# Altium project stm8_sensor.PrjPcb
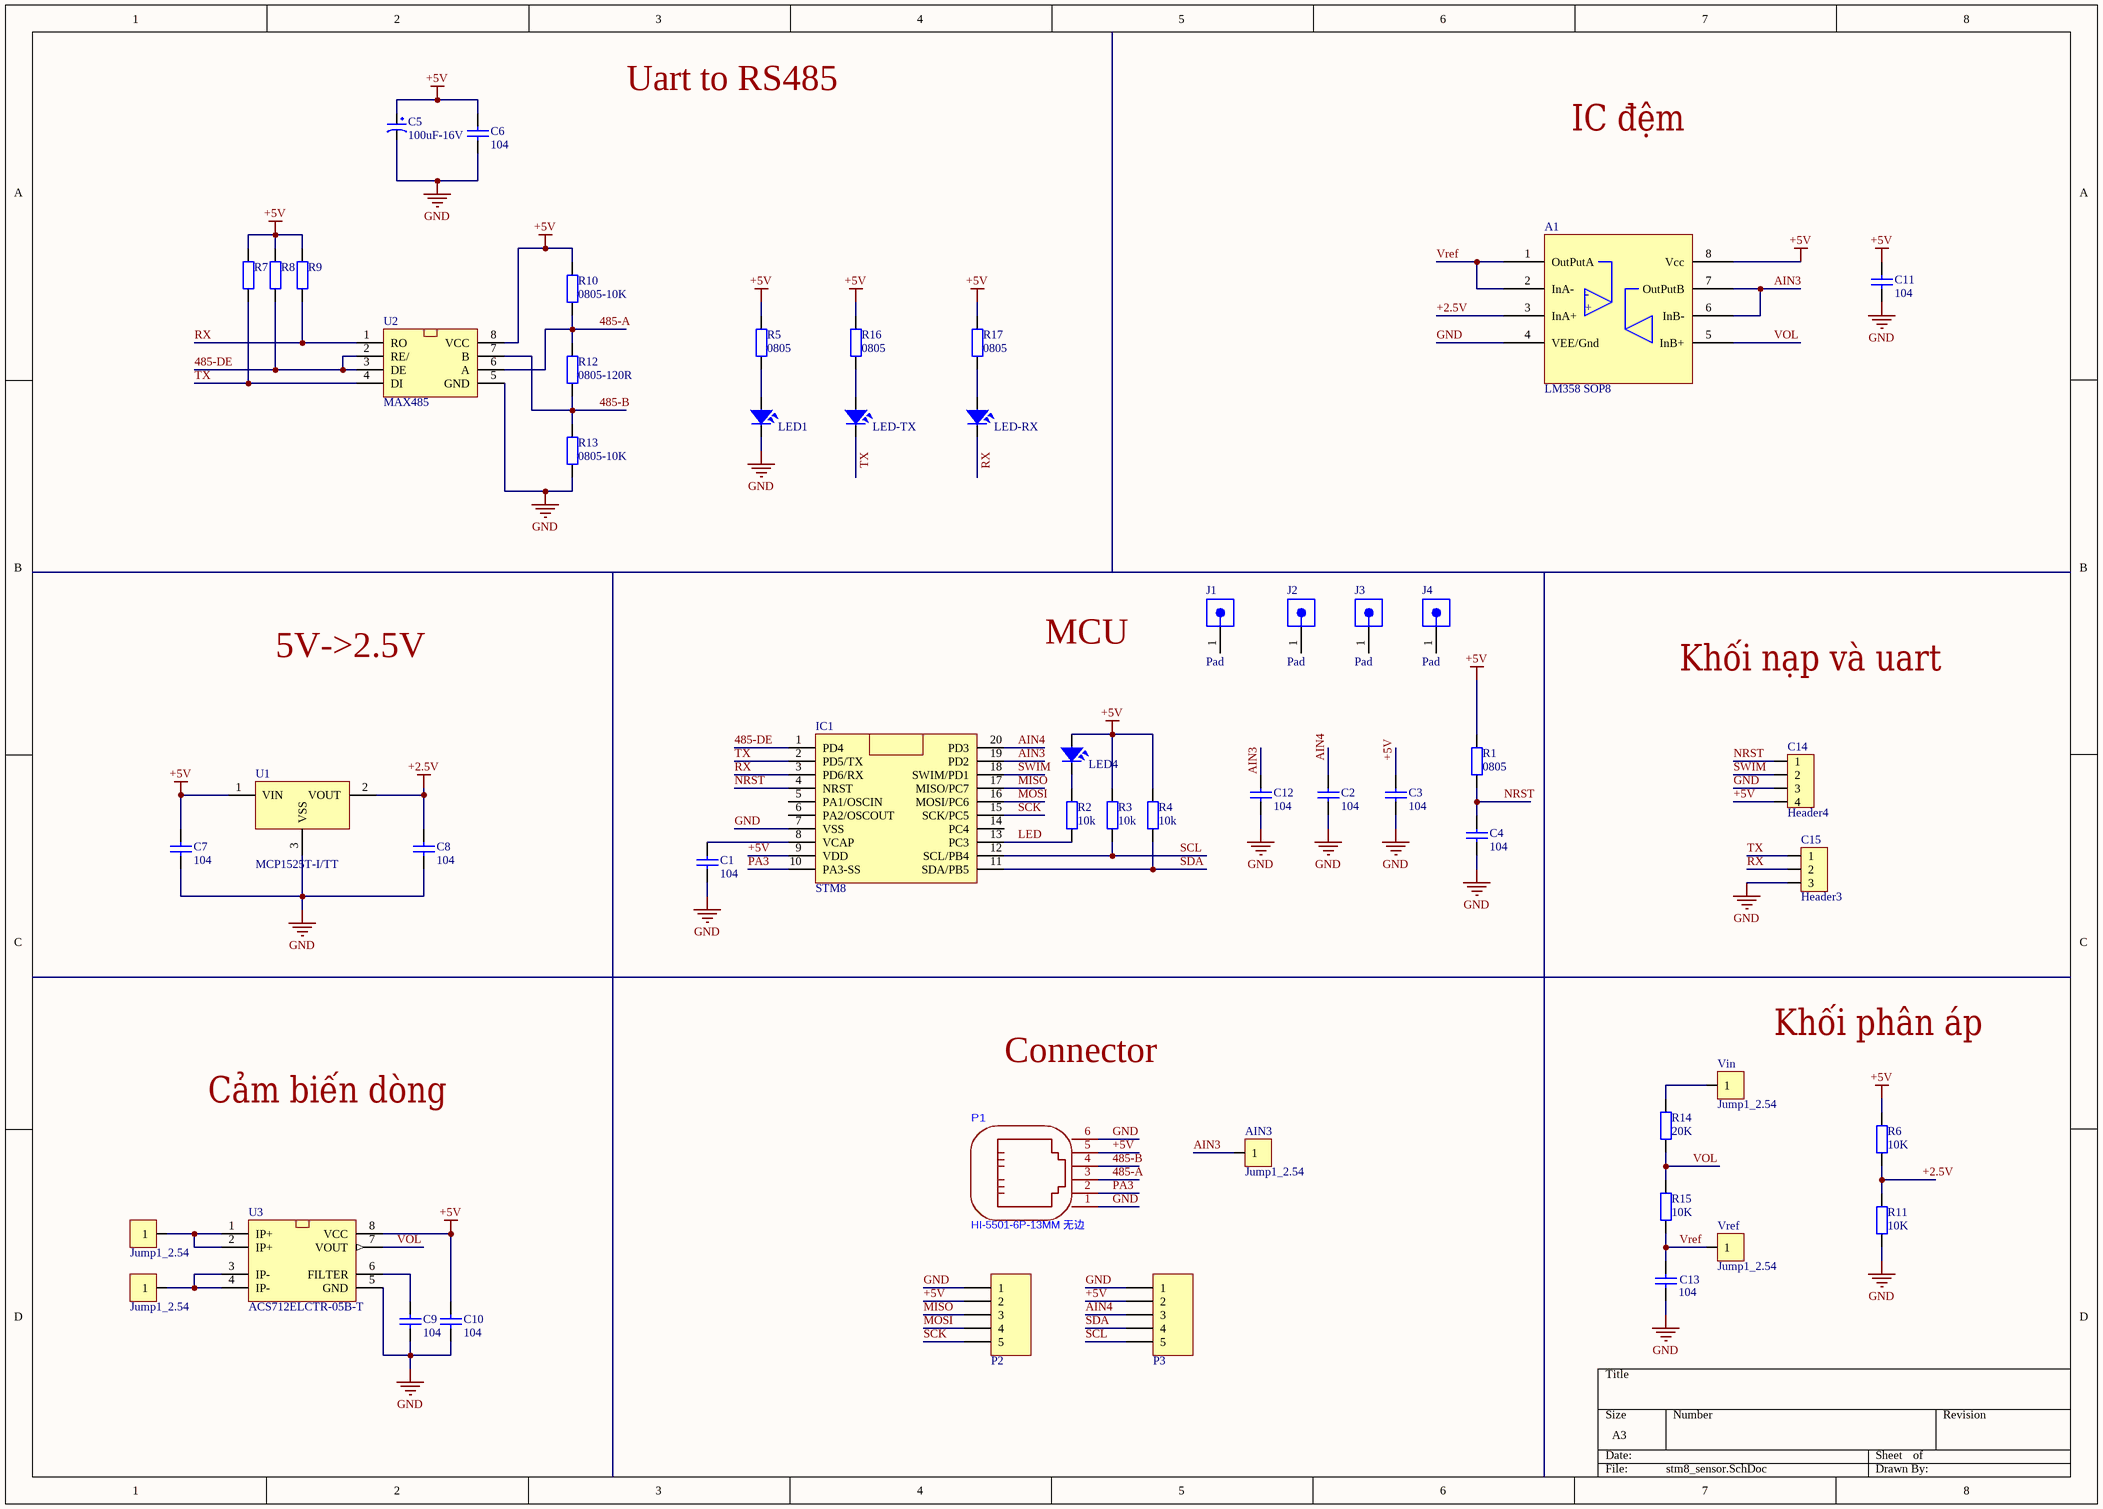
[diagram p0: stm8_sensor.SchDoc]
1 sheet, 53 parts. Net scope: global (net labels, ports and power ports of the same name join across sheets).
Board file: stm8_sensor.PcbDoc

## Sheet stm8_sensor.SchDoc
size A3; SheetNumber: 1; SheetTotal: 1

### Parts
A1  LM358 SOP8  [LM358_SOIC]
AIN3  Jump1_2.54  [jump1_2.54]
C1  104  [0805]
C2  104  [0805]
C3  104  [0805]
C4  104  [0805]
C5  100uF-16V  [tu tantalum smd3216]
C6  104  [tu 0805]
C7  104  [Tu 0805]
C8  104  [Tu 0805]
C9  104  [Tu 0805]
C10  104  [Tu 0805]
C11  104  [Tu 0805]
C12  104  [0805]
C13  104  [Tu 0805]
C14  Header4  [Header4]
C15  Header3  [Header3]
IC1  STM8  [TSSOP 20PIN]
IP+  Jump1_2.54  [jump1_2.54]
IP-  Jump1_2.54  [jump1_2.54]
J1  Pad  [Pad_4.5x4.5_hole_3.2mm_no_legend]
J2  Pad  [Pad_4.5x4.5_hole_3.2mm_no_legend]
J3  Pad  [Pad_4.5x4.5_hole_3.2mm_no_legend]
J4  Pad  [Pad_4.5x4.5_hole_3.2mm_no_legend]
LED1  LED  [LED-5-Yellow]  (value not drawn)
LED4  LED  [LED-5-RED]  (value not drawn)
LED-RX  LED  [LED-5-Green]  (value not drawn)
LED-TX  LED  [LED-5-BLUE]  (value not drawn)
P1  HI-5501-6P-13MM 无边  [RJ11-TH_PCB-6P6C-90]
P2  Connector  [JST-XH_B5B-XH-A]  (value not drawn)
P3  Connector  [JST-XH_B5B-XH-A]  (value not drawn)
R1  value 0805  [DIEN TRO 0805]  (hidden comment: R0805)
R2  value 10k  [DIEN TRO 0805]  (hidden comment: R0805)
R3  value 10k  [DIEN TRO 0805]  (hidden comment: R0805)
R4  value 10k  [DIEN TRO 0805]  (hidden comment: R0805)
R5  value 0805  [DIEN TRO 0805]  (hidden comment: R0805)
R6  value 10K  [DIEN TRO 0805]  (hidden comment: R0805)
R7  R0805  [DIEN TRO 0805]  (value not drawn)
R8  R0805  [DIEN TRO 0805]  (value not drawn)
R9  R0805  [DIEN TRO 0805]  (value not drawn)
R10  value 0805-10K  [DIEN TRO 0805]  (hidden comment: R0805)
R11  value 10K  [DIEN TRO 0805]  (hidden comment: R0805)
R12  value 0805-120R  [DIEN TRO 0805]  (hidden comment: R0805)
R13  value 0805-10K  [DIEN TRO 0805]  (hidden comment: R0805)
R14  value 20K  [DIEN TRO 0805]  (hidden comment: R0805)
R15  value 10K  [DIEN TRO 0805]  (hidden comment: R0805)
R16  value 0805  [DIEN TRO 0805]  (hidden comment: R0805)
R17  value 0805  [DIEN TRO 0805]  (hidden comment: R0805)
U1  MCP1525T-I/TT  [SOT23]
U2  MAX485  [SOP8_L]
U3  ACS712ELCTR-05B-T  [SOP8_L]
Vin  Jump1_2.54  [jump1_2.54]
Vref  Jump1_2.54  [jump1_2.54]

### Nets
+2.5V: A1.3(InA+) C8.2 R6.1 R11.2 U1.2(VOUT)
+5V: A1.8(Vcc) C3.2 C5.1 C6.1 C7.2 C10.2 C11.2 C14.4 IC1.9(VDD) LED4.1 P1.5 P2.2 P3.2 R1.2 R3.2 R4.2 R5.2 R6.2 R7.2 R8.2 R9.2 R10.2 R16.2 R17.2 U1.1(VIN) U2.8(VCC) U3.8(VCC)
GND: A1.4(VEE/Gnd) C1.1 C2.1 C3.1 C4.1 C5.2 C6.2 C7.1 C8.1 C9.1 C10.1 C11.1 C12.2 C13.1 C14.3 C15.3 IC1.7(VSS) LED1.2 P1.1 P1.6 P2.1 P3.1 R11.1 R13.1 U1.3(VSS) U2.5(GND) U3.5(GND)
485-A: P1.3 R10.1 R12.2 U2.6(A)
485-B: P1.4 R12.1 R13.2 U2.7(B)
485-DE: IC1.1(PD4) R8.1 U2.2(RE/) U2.3(DE)
AIN3: A1.6(InB-) A1.7(OutPutB) AIN3.1 C12.1 IC1.19(PD2)
AIN4: C2.2 IC1.20(PD3) P3.3
LED: IC1.13(PC3) R2.1
MISO: IC1.17(MISO/PC7) P2.3
MOSI: IC1.16(MOSI/PC6) P2.4
NRST: C4.2 C14.1 IC1.4(NRST) R1.1
PA3: IC1.10(PA3-SS) P1.2
RX: C15.2 IC1.3(PD6/RX) LED-RX.2 R9.1 U2.1(RO)
SCK: IC1.15(SCK/PC5) P2.5
SCL: IC1.12(SCL/PB4) P3.5 R3.1
SDA: IC1.11(SDA/PB5) P3.4 R4.1
SWIM: C14.2 IC1.18(SWIM/PD1)
TX: C15.1 IC1.2(PD5/TX) LED-TX.2 R7.1 U2.4(DI)
VOL: A1.5(InB+) R14.1 R15.2 U3.7(VOUT)
Vref: A1.1(OutPutA) A1.2(InA-) C13.2 R15.1 Vref.1
NetC1_2: C1.2 IC1.8(VCAP)
NetC9_2: C9.2 U3.6(FILTER)
NetIP+_1: IP+.1 U3.1(IP+) U3.2(IP+)
NetIP-_1: IP-.1 U3.3(IP-) U3.4(IP-)
NetLED1_1: LED1.1 R5.1
NetLED4_2: LED4.2 R2.2
NetLED-RX_1: LED-RX.1 R17.1
NetLED-TX_1: LED-TX.1 R16.1
NetR14_2: R14.2 Vin.1

Not connected (* = marked no-connect by the designer): IC1 5(PA1/OSCIN) 6(PA2/OSCOUT) 14(PC4); J1 1; J2 1; J3 1; J4 1

### Notes on the sheet
- Uart to RS485
- IC đệm
- MCU
- 5V->2.5V
- Khối nạp và uart
- Khối phân áp
- Cảm biến dòng
- Connector
- (in symbol LM358) -; +

### Library data of the parts
A1 = LM358: Dán; Ma_Hang: MH000609; Don_Vi: Con; Ten_Linh_Kien: LM358 SOP8; Kieu_Chan: *; Ghi_Chu: *; Chung_Loai: Dán
AIN3 IP+ IP- Vin Vref = jump_1
C1-C4 C12 = Cap 104_SMD: Capacitor (Semiconductor SIM Model); Value: 0.1uF; Published: 8-Jun-2000; LatestRevisionDate: 17-Jul-2002; LatestRevisionNote: Re-released for DXP Platform.; PackageReference: C1206; Publisher: Altium Limited
C5 = Tu tantalum 1uF 35V SMD3216: Dán; Don_Vi: Con; So_Chan: 2; Ten_Linh_Kien: Tụ tantalum 105V-1uF 35V SMD3216; Ma_Hang: MH007471; Chung_Loai: Dán; Kieu_Chan: *
C6 = Tu 0805 104 50V 10%: Dán; Don_Vi: Con; So_Chan: 2; Ten_Linh_Kien: Tụ 0805 104-100nF 10% 50V; Ma_Hang: MH004551; Chung_Loai: Dán; Kieu_Chan: *
C7-C11 C13 = Tu 104: Dán; Ten_Linh_Kien: Tụ 0805 104-100nF 10% 50V; Don_Vi: Con; Ma_Hang: MH004551; Kieu_Chan: *; Chung_Loai: Dán; Ghi_Chu: *
C14 = Header4: Header IDC, 4 x 1 Pin Vertical 2.54mm Pitch (Non-Boxed, Male); Manufacturer: W¨¹rth Elektronik eiSos GmbH; partNo: 613002143121; ComponentLink1 Description: Manufacturer; ComponentLink2 Description: Datasheet; NoPins: 02; Created Date: 29 March 2013; ComponentLink1URL: http://www.we-online.com; ComponentLink2URL: http://katalog.we-online.de/em/datasheet/6130xx143121.pdf; Created by: Karrer Zheng
C15 = Header3: Header IDC, 3 x 1 Pin Vertical 2.54mm Pitch (Non-Boxed, Male); Manufacturer: W¨¹rth Elektronik eiSos GmbH; partNo: 613002143121; ComponentLink1 Description: Manufacturer; ComponentLink2 Description: Datasheet; NoPins: 02; Created Date: 29 March 2013; ComponentLink1URL: http://www.we-online.com; ComponentLink2URL: http://katalog.we-online.de/em/datasheet/6130xx143121.pdf; Created by: Karrer Zheng
IC1 = STM8S103F3_20P: STM32 ARM MCU
J1-J4 = Pad: Ports: 1; Positions/Loaded: Port1 - 4/2; PerformanceCategory: 3; PCB_Mounting: Thru-Hole; PCB_Thickness: 0.125"; DrillSize: Nominal, Rounded to nearest 0.05mm; PCB_Layout: Complies with Manufacturer's Recommendation.; Published: 25-Jun-2002; DatasheetDocument: 20-Nov-2001; PackageDocument: 20-Nov-2001; PackageReference: 42878-4410; Publisher: Altium Limited; ComponentLink1Description: Manufacturer Link; ComponentLink1URL: http://www.molex.com/; ComponentLink2Description: Datasheet; ComponentLink2URL: http://www.molex.com/cmc_upload/common_files/1212003_42878catalogpage.pdf
LED1 LED4 LED-RX LED-TX = LED: LED Single colour Green and Red; Value: LED 3 ly Single Colour
P2 P3 = Connector_5pin
R1-R6 R10-R17 = R0805: Resistor SMD 0805; Published: 8-Jun-2000; LatestRevisionDate: 17-Jul-2002; LatestRevisionNote: Re-released for DXP Platform.; PackageReference: AXIAL-0.4; Publisher: Altium Limited
R7-R9 = R0805: Resistor SMD 0805; Value: 0805-10K; Published: 8-Jun-2000; LatestRevisionDate: 17-Jul-2002; LatestRevisionNote: Re-released for DXP Platform.; PackageReference: AXIAL-0.4; Publisher: Altium Limited
U1 = MCP1525T: 2.5V And 4.096V Voltage References
U3 = ACS712ELCTR-05B-T: SENSOR CURRENT HALL 5A AC/DC